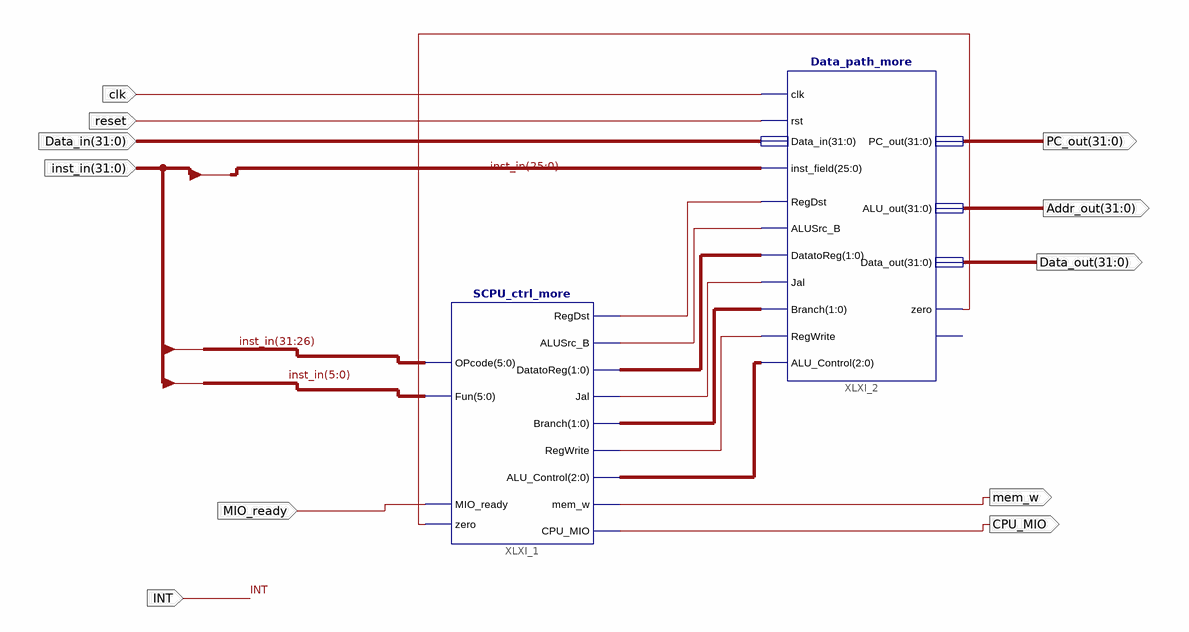
[diagram p0: schematic sheet 1]
// Xilinx ISE schematic SCPU.sch (kintex7) as structural Verilog: 2 symbols, 11 ports
module SCPU (
  input  clk,
  input  reset,
  input  [31:0] Data_in,
  input  [31:0] inst_in,
  input  MIO_ready,
  input  INT,
  output mem_w,
  output CPU_MIO,
  output [31:0] PC_out,
  output [31:0] Addr_out,
  output [31:0] Data_out
);

  wire XLXN_22, XLXN_23, XLXN_25, XLXN_27, XLXN_35;
  wire [1:0] XLXN_11, XLXN_13;
  wire [2:0] XLXN_15;

  SCPU_ctrl_more XLXI_1 (
    .RegDst(XLXN_22), .ALUSrc_B(XLXN_23), .DatatoReg(XLXN_11), .Jal(XLXN_25), .ALU_Control(XLXN_15),
    .CPU_MIO(CPU_MIO), .mem_w(mem_w), .Fun(inst_in[5:0]), .OPcode(inst_in[31:26]), .Branch(XLXN_13),
    .RegWrite(XLXN_27), .MIO_ready(MIO_ready), .zero(XLXN_35));
  Data_path_more XLXI_2 (
    .RegDst(XLXN_22), .ALUSrc_B(XLXN_23), .DatatoReg(XLXN_11), .Jal(XLXN_25), .Branch(XLXN_13),
    .RegWrite(XLXN_27), .ALU_Control(XLXN_15), .Data_in(Data_in), .inst_field(inst_in[25:0]), .clk(clk),
    .rst(reset), .PC_out(PC_out), .ALU_out(Addr_out), .Data_out(Data_out), .zero(XLXN_35));  // open: overflow
endmodule
